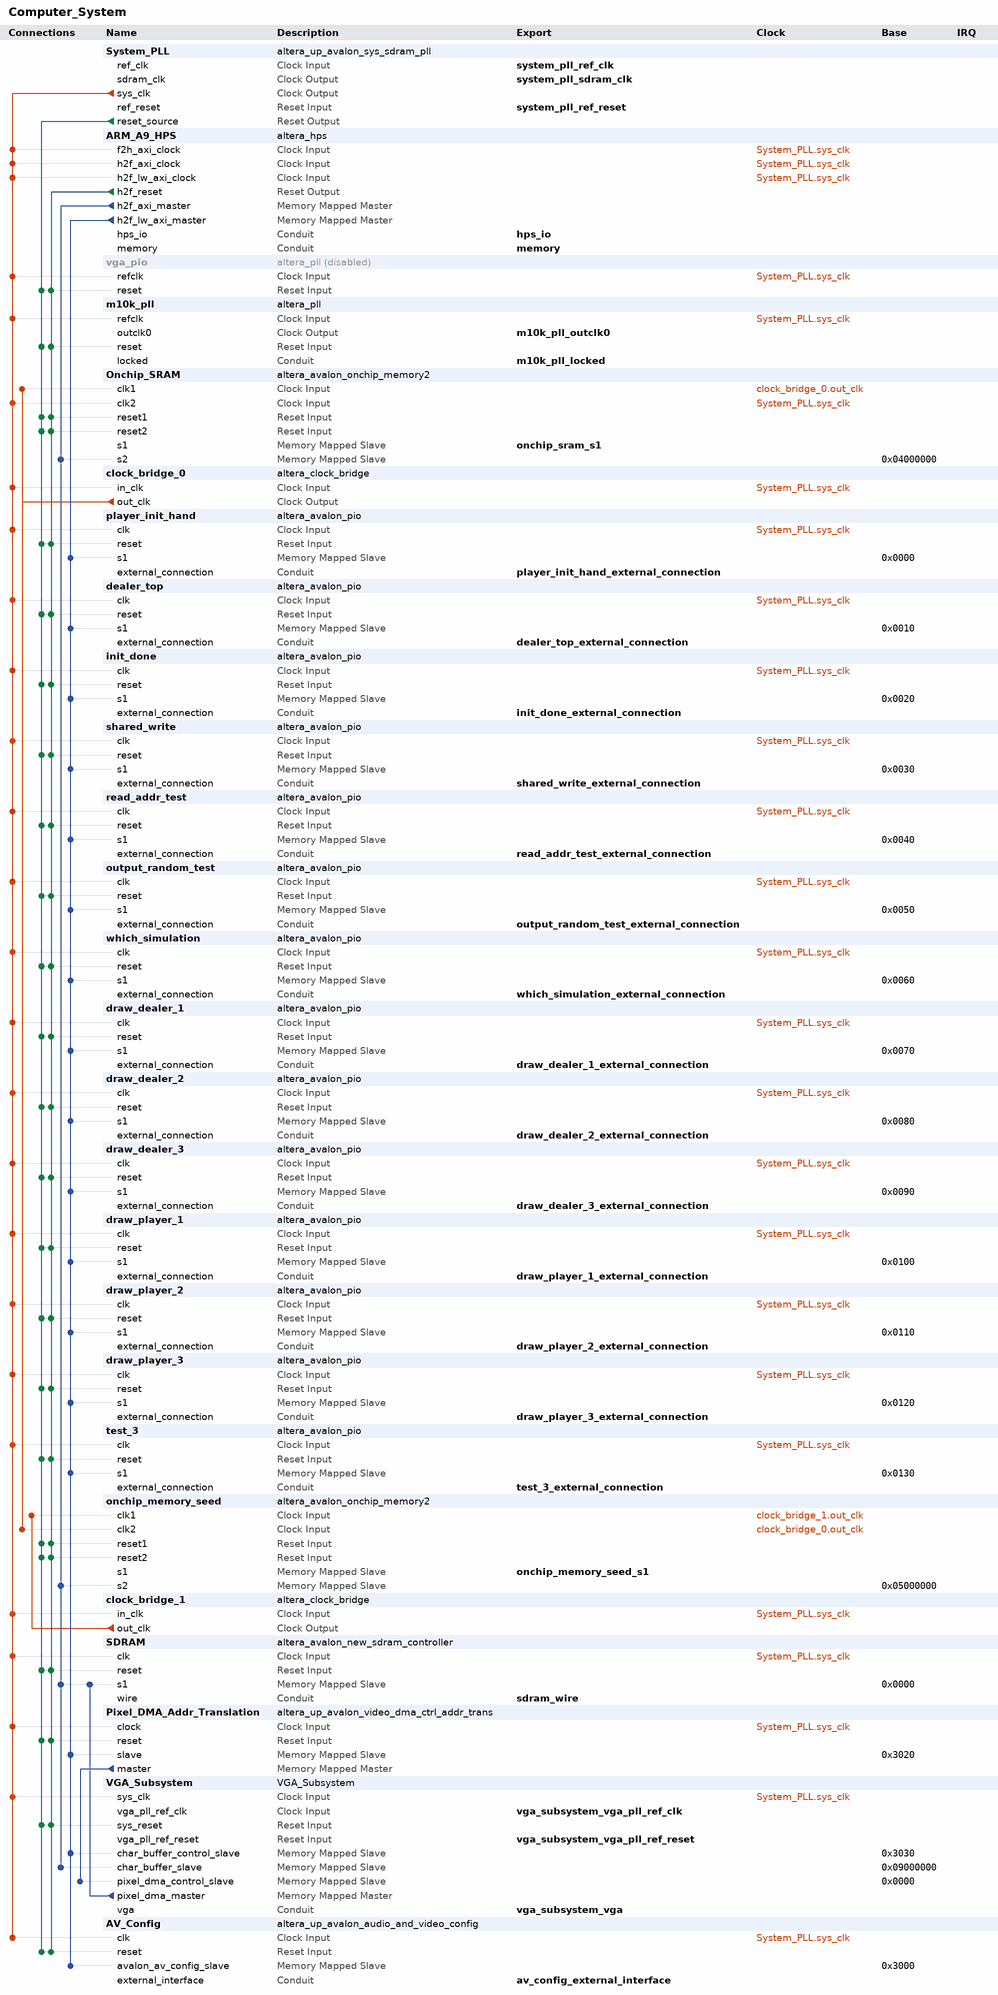
[diagram p0: system contents]
# Platform Designer (Qsys) system Computer_System, Cyclone V 5CSEMA5F31C6
# Parameters at their usual value, and those the tool derives, are not listed.
package require -exact qsys 18.1
create_system Computer_System
set_project_property DEVICE_FAMILY {Cyclone V}
set_project_property DEVICE 5CSEMA5F31C6

add_instance System_PLL altera_up_avalon_sys_sdram_pll 18.0
set_instance_parameter_value System_PLL CV_boards DE1-SoC
set_instance_parameter_value System_PLL gui_outclk 100.0
set_instance_parameter_value System_PLL gui_refclk 50.0

add_instance ARM_A9_HPS altera_hps 18.1
set_instance_parameter_value ARM_A9_HPS EMAC1_Mode RGMII
set_instance_parameter_value ARM_A9_HPS EMAC1_PinMuxing {HPS I/O Set 0}
set_instance_parameter_value ARM_A9_HPS F2SCLK_COLDRST_Enable false
set_instance_parameter_value ARM_A9_HPS F2SCLK_DBGRST_Enable false
set_instance_parameter_value ARM_A9_HPS F2SCLK_WARMRST_Enable false
set_instance_parameter_value ARM_A9_HPS F2SINTERRUPT_Enable true
set_instance_parameter_value ARM_A9_HPS F2S_Width 2
set_instance_parameter_value ARM_A9_HPS FPGA_PERIPHERAL_OUTPUT_CLOCK_FREQ_EMAC0_GTX_CLK 125
set_instance_parameter_value ARM_A9_HPS FPGA_PERIPHERAL_OUTPUT_CLOCK_FREQ_EMAC0_MD_CLK 100.0
set_instance_parameter_value ARM_A9_HPS FPGA_PERIPHERAL_OUTPUT_CLOCK_FREQ_EMAC1_GTX_CLK 125
set_instance_parameter_value ARM_A9_HPS FPGA_PERIPHERAL_OUTPUT_CLOCK_FREQ_EMAC1_MD_CLK 100.0
set_instance_parameter_value ARM_A9_HPS HPS_PROTOCOL DDR3
set_instance_parameter_value ARM_A9_HPS I2C0_Mode I2C
set_instance_parameter_value ARM_A9_HPS I2C0_PinMuxing {HPS I/O Set 0}
set_instance_parameter_value ARM_A9_HPS I2C1_Mode I2C
set_instance_parameter_value ARM_A9_HPS I2C1_PinMuxing {HPS I/O Set 0}
set_instance_parameter_value ARM_A9_HPS LWH2F_Enable true
set_instance_parameter_value ARM_A9_HPS MEM_BANKADDR_WIDTH 3
set_instance_parameter_value ARM_A9_HPS MEM_CLK_FREQ 400.0
set_instance_parameter_value ARM_A9_HPS MEM_COL_ADDR_WIDTH 10
set_instance_parameter_value ARM_A9_HPS MEM_DQ_WIDTH 32
set_instance_parameter_value ARM_A9_HPS MEM_DRV_STR RZQ/7
set_instance_parameter_value ARM_A9_HPS MEM_ROW_ADDR_WIDTH 15
set_instance_parameter_value ARM_A9_HPS MEM_RTT_NOM RZQ/4
set_instance_parameter_value ARM_A9_HPS MEM_RTT_WR RZQ/4
set_instance_parameter_value ARM_A9_HPS MEM_TCL 11
set_instance_parameter_value ARM_A9_HPS MEM_TFAW_NS 30.0
set_instance_parameter_value ARM_A9_HPS MEM_TRAS_NS 35.0
set_instance_parameter_value ARM_A9_HPS MEM_TRCD_NS 13.75
set_instance_parameter_value ARM_A9_HPS MEM_TRFC_NS 260.0
set_instance_parameter_value ARM_A9_HPS MEM_TRP_NS 13.75
set_instance_parameter_value ARM_A9_HPS MEM_VENDOR JEDEC
set_instance_parameter_value ARM_A9_HPS MEM_WTCL 8
set_instance_parameter_value ARM_A9_HPS QSPI_Mode {1 SS}
set_instance_parameter_value ARM_A9_HPS QSPI_PinMuxing {HPS I/O Set 0}
set_instance_parameter_value ARM_A9_HPS REF_CLK_FREQ 25.0
set_instance_parameter_value ARM_A9_HPS S2FCLK_USER2CLK 5
set_instance_parameter_value ARM_A9_HPS S2F_Width 3
set_instance_parameter_value ARM_A9_HPS SDIO_Mode {4-bit Data}
set_instance_parameter_value ARM_A9_HPS SDIO_PinMuxing {HPS I/O Set 0}
set_instance_parameter_value ARM_A9_HPS SPIM1_Mode {Single Slave Select}
set_instance_parameter_value ARM_A9_HPS SPIM1_PinMuxing {HPS I/O Set 0}
set_instance_parameter_value ARM_A9_HPS STM_Enable false
set_instance_parameter_value ARM_A9_HPS TIMING_BOARD_AC_SKEW 0.03
set_instance_parameter_value ARM_A9_HPS TIMING_BOARD_AC_TO_CK_SKEW 0.0
set_instance_parameter_value ARM_A9_HPS TIMING_BOARD_DQ_TO_DQS_SKEW 0.0
set_instance_parameter_value ARM_A9_HPS TIMING_BOARD_MAX_CK_DELAY 0.03
set_instance_parameter_value ARM_A9_HPS TIMING_BOARD_MAX_DQS_DELAY 0.02
set_instance_parameter_value ARM_A9_HPS TIMING_BOARD_SKEW_BETWEEN_DQS 0.08
set_instance_parameter_value ARM_A9_HPS TIMING_BOARD_SKEW_CKDQS_DIMM_MAX 0.16
set_instance_parameter_value ARM_A9_HPS TIMING_BOARD_SKEW_CKDQS_DIMM_MIN 0.09
set_instance_parameter_value ARM_A9_HPS TIMING_BOARD_SKEW_WITHIN_DQS 0.01
set_instance_parameter_value ARM_A9_HPS TIMING_TDH 65
set_instance_parameter_value ARM_A9_HPS TIMING_TDQSCK 255
set_instance_parameter_value ARM_A9_HPS TIMING_TDQSQ 125
set_instance_parameter_value ARM_A9_HPS TIMING_TDS 30
set_instance_parameter_value ARM_A9_HPS TIMING_TIH 140
set_instance_parameter_value ARM_A9_HPS TIMING_TIS 180
set_instance_parameter_value ARM_A9_HPS TIMING_TQSH 0.4
set_instance_parameter_value ARM_A9_HPS UART0_Mode {No Flow Control}
set_instance_parameter_value ARM_A9_HPS UART0_PinMuxing {HPS I/O Set 0}
set_instance_parameter_value ARM_A9_HPS USB1_Mode SDR
set_instance_parameter_value ARM_A9_HPS USB1_PinMuxing {HPS I/O Set 0}
set_instance_parameter_value ARM_A9_HPS desired_cfg_clk_mhz 100.0
set_instance_parameter_value ARM_A9_HPS desired_qspi_clk_mhz 400.0

add_instance vga_pio altera_pll 18.1
set_instance_property vga_pio ENABLED false
set_instance_parameter_value vga_pio gui_device_speed_grade 2
set_instance_parameter_value vga_pio gui_number_of_clocks 1
set_instance_parameter_value vga_pio gui_operation_mode direct
set_instance_parameter_value vga_pio gui_output_clock_frequency0 25.0
set_instance_parameter_value vga_pio gui_pll_mode {Integer-N PLL}
set_instance_parameter_value vga_pio gui_reference_clock_frequency 100.0
set_instance_parameter_value vga_pio gui_use_locked true

add_instance m10k_pll altera_pll 18.1
set_instance_parameter_value m10k_pll gui_device_speed_grade 2
set_instance_parameter_value m10k_pll gui_number_of_clocks 1
set_instance_parameter_value m10k_pll gui_operation_mode direct
set_instance_parameter_value m10k_pll gui_output_clock_frequency0 100.0
set_instance_parameter_value m10k_pll gui_pll_mode {Integer-N PLL}
set_instance_parameter_value m10k_pll gui_reference_clock_frequency 100.0
set_instance_parameter_value m10k_pll gui_use_locked true

add_instance Onchip_SRAM altera_avalon_onchip_memory2 18.1
set_instance_parameter_value Onchip_SRAM blockType M10K
set_instance_parameter_value Onchip_SRAM dataWidth 32
set_instance_parameter_value Onchip_SRAM dualPort true
set_instance_parameter_value Onchip_SRAM initMemContent true
set_instance_parameter_value Onchip_SRAM initializationFileName onchip_mem.hex
set_instance_parameter_value Onchip_SRAM memorySize 1248

add_instance clock_bridge_0 altera_clock_bridge 18.1
set_instance_parameter_value clock_bridge_0 DERIVED_CLOCK_RATE 100000000
set_instance_parameter_value clock_bridge_0 EXPLICIT_CLOCK_RATE 50000000

add_instance player_init_hand altera_avalon_pio 18.1
set_instance_parameter_value player_init_hand direction Output
set_instance_parameter_value player_init_hand width 8

add_instance dealer_top altera_avalon_pio 18.1
set_instance_parameter_value dealer_top direction Output
set_instance_parameter_value dealer_top width 8

add_instance init_done altera_avalon_pio 18.1
set_instance_parameter_value init_done direction Output
set_instance_parameter_value init_done width 8

add_instance shared_write altera_avalon_pio 18.1
set_instance_parameter_value shared_write direction Input
set_instance_parameter_value shared_write width 8

add_instance read_addr_test altera_avalon_pio 18.1
set_instance_parameter_value read_addr_test direction Input
set_instance_parameter_value read_addr_test width 8

add_instance output_random_test altera_avalon_pio 18.1
set_instance_parameter_value output_random_test direction Input
set_instance_parameter_value output_random_test width 32

add_instance which_simulation altera_avalon_pio 18.1
set_instance_parameter_value which_simulation direction Output
set_instance_parameter_value which_simulation width 8

add_instance draw_dealer_1 altera_avalon_pio 18.1
set_instance_parameter_value draw_dealer_1 direction Input
set_instance_parameter_value draw_dealer_1 width 8

add_instance draw_dealer_2 altera_avalon_pio 18.1
set_instance_parameter_value draw_dealer_2 direction Input
set_instance_parameter_value draw_dealer_2 width 8

add_instance draw_dealer_3 altera_avalon_pio 18.1
set_instance_parameter_value draw_dealer_3 direction Input
set_instance_parameter_value draw_dealer_3 width 8

add_instance draw_player_1 altera_avalon_pio 18.1
set_instance_parameter_value draw_player_1 direction Input
set_instance_parameter_value draw_player_1 width 8

add_instance draw_player_2 altera_avalon_pio 18.1
set_instance_parameter_value draw_player_2 direction Input
set_instance_parameter_value draw_player_2 width 8

add_instance draw_player_3 altera_avalon_pio 18.1
set_instance_parameter_value draw_player_3 direction Input
set_instance_parameter_value draw_player_3 width 8

add_instance test_3 altera_avalon_pio 18.1
set_instance_parameter_value test_3 direction Input
set_instance_parameter_value test_3 width 8

add_instance onchip_memory_seed altera_avalon_onchip_memory2 18.1
set_instance_parameter_value onchip_memory_seed blockType M10K
set_instance_parameter_value onchip_memory_seed dataWidth 32
set_instance_parameter_value onchip_memory_seed dualPort true
set_instance_parameter_value onchip_memory_seed initMemContent true
set_instance_parameter_value onchip_memory_seed initializationFileName onchip_mem.hex
set_instance_parameter_value onchip_memory_seed memorySize 10000

add_instance clock_bridge_1 altera_clock_bridge 18.1
set_instance_parameter_value clock_bridge_1 DERIVED_CLOCK_RATE 100000000
set_instance_parameter_value clock_bridge_1 EXPLICIT_CLOCK_RATE 50000000

add_instance SDRAM altera_avalon_new_sdram_controller 18.1
set_instance_parameter_value SDRAM TAC 5.5
set_instance_parameter_value SDRAM TRCD 20.0
set_instance_parameter_value SDRAM TRP 20.0
set_instance_parameter_value SDRAM casLatency 3
set_instance_parameter_value SDRAM columnWidth 10
set_instance_parameter_value SDRAM dataWidth 16
set_instance_parameter_value SDRAM generateSimulationModel true
set_instance_parameter_value SDRAM model single_Micron_MT48LC4M32B2_7_chip
set_instance_parameter_value SDRAM numberOfBanks 4
set_instance_parameter_value SDRAM numberOfChipSelects 1
set_instance_parameter_value SDRAM powerUpDelay 100.0
set_instance_parameter_value SDRAM refreshPeriod 15.625
set_instance_parameter_value SDRAM rowWidth 13

add_instance Pixel_DMA_Addr_Translation altera_up_avalon_video_dma_ctrl_addr_trans 18.0

add_instance VGA_Subsystem VGA_Subsystem 1.0

add_instance AV_Config altera_up_avalon_audio_and_video_config 18.0
set_instance_parameter_value AV_Config audio_in {Microphone to ADC}
set_instance_parameter_value AV_Config bit_length 32
set_instance_parameter_value AV_Config board DE1-SoC
set_instance_parameter_value AV_Config line_in_bypass false
set_instance_parameter_value AV_Config sampling_rate {48 kHz}

# connections
add_connection clock_bridge_0.out_clk onchip_memory_seed.clk2 clock
add_connection clock_bridge_0.out_clk Onchip_SRAM.clk1 clock
add_connection clock_bridge_1.out_clk onchip_memory_seed.clk1 clock
add_connection System_PLL.sys_clk ARM_A9_HPS.f2h_axi_clock clock
add_connection System_PLL.sys_clk ARM_A9_HPS.h2f_axi_clock clock
add_connection System_PLL.sys_clk ARM_A9_HPS.h2f_lw_axi_clock clock
add_connection System_PLL.sys_clk AV_Config.clk clock
add_connection System_PLL.sys_clk clock_bridge_0.in_clk clock
add_connection System_PLL.sys_clk clock_bridge_1.in_clk clock
add_connection System_PLL.sys_clk dealer_top.clk clock
add_connection System_PLL.sys_clk draw_dealer_1.clk clock
add_connection System_PLL.sys_clk draw_dealer_2.clk clock
add_connection System_PLL.sys_clk draw_dealer_3.clk clock
add_connection System_PLL.sys_clk draw_player_1.clk clock
add_connection System_PLL.sys_clk draw_player_2.clk clock
add_connection System_PLL.sys_clk draw_player_3.clk clock
add_connection System_PLL.sys_clk init_done.clk clock
add_connection System_PLL.sys_clk m10k_pll.refclk clock
add_connection System_PLL.sys_clk Onchip_SRAM.clk2 clock
add_connection System_PLL.sys_clk output_random_test.clk clock
add_connection System_PLL.sys_clk Pixel_DMA_Addr_Translation.clock clock
add_connection System_PLL.sys_clk player_init_hand.clk clock
add_connection System_PLL.sys_clk read_addr_test.clk clock
add_connection System_PLL.sys_clk SDRAM.clk clock
add_connection System_PLL.sys_clk shared_write.clk clock
add_connection System_PLL.sys_clk test_3.clk clock
add_connection System_PLL.sys_clk vga_pio.refclk clock
add_connection System_PLL.sys_clk VGA_Subsystem.sys_clk clock
add_connection System_PLL.sys_clk which_simulation.clk clock
add_connection ARM_A9_HPS.h2f_reset AV_Config.reset reset
add_connection ARM_A9_HPS.h2f_reset dealer_top.reset reset
add_connection ARM_A9_HPS.h2f_reset draw_dealer_1.reset reset
add_connection ARM_A9_HPS.h2f_reset draw_dealer_2.reset reset
add_connection ARM_A9_HPS.h2f_reset draw_dealer_3.reset reset
add_connection ARM_A9_HPS.h2f_reset draw_player_1.reset reset
add_connection ARM_A9_HPS.h2f_reset draw_player_2.reset reset
add_connection ARM_A9_HPS.h2f_reset draw_player_3.reset reset
add_connection ARM_A9_HPS.h2f_reset init_done.reset reset
add_connection ARM_A9_HPS.h2f_reset m10k_pll.reset reset
add_connection ARM_A9_HPS.h2f_reset onchip_memory_seed.reset1 reset
add_connection ARM_A9_HPS.h2f_reset onchip_memory_seed.reset2 reset
add_connection ARM_A9_HPS.h2f_reset Onchip_SRAM.reset1 reset
add_connection ARM_A9_HPS.h2f_reset Onchip_SRAM.reset2 reset
add_connection ARM_A9_HPS.h2f_reset output_random_test.reset reset
add_connection ARM_A9_HPS.h2f_reset Pixel_DMA_Addr_Translation.reset reset
add_connection ARM_A9_HPS.h2f_reset player_init_hand.reset reset
add_connection ARM_A9_HPS.h2f_reset read_addr_test.reset reset
add_connection ARM_A9_HPS.h2f_reset SDRAM.reset reset
add_connection ARM_A9_HPS.h2f_reset shared_write.reset reset
add_connection ARM_A9_HPS.h2f_reset test_3.reset reset
add_connection ARM_A9_HPS.h2f_reset vga_pio.reset reset
add_connection ARM_A9_HPS.h2f_reset VGA_Subsystem.sys_reset reset
add_connection ARM_A9_HPS.h2f_reset which_simulation.reset reset
add_connection System_PLL.reset_source AV_Config.reset reset
add_connection System_PLL.reset_source dealer_top.reset reset
add_connection System_PLL.reset_source draw_dealer_1.reset reset
add_connection System_PLL.reset_source draw_dealer_2.reset reset
add_connection System_PLL.reset_source draw_dealer_3.reset reset
add_connection System_PLL.reset_source draw_player_1.reset reset
add_connection System_PLL.reset_source draw_player_2.reset reset
add_connection System_PLL.reset_source draw_player_3.reset reset
add_connection System_PLL.reset_source init_done.reset reset
add_connection System_PLL.reset_source m10k_pll.reset reset
add_connection System_PLL.reset_source onchip_memory_seed.reset1 reset
add_connection System_PLL.reset_source onchip_memory_seed.reset2 reset
add_connection System_PLL.reset_source Onchip_SRAM.reset1 reset
add_connection System_PLL.reset_source Onchip_SRAM.reset2 reset
add_connection System_PLL.reset_source output_random_test.reset reset
add_connection System_PLL.reset_source Pixel_DMA_Addr_Translation.reset reset
add_connection System_PLL.reset_source player_init_hand.reset reset
add_connection System_PLL.reset_source read_addr_test.reset reset
add_connection System_PLL.reset_source SDRAM.reset reset
add_connection System_PLL.reset_source shared_write.reset reset
add_connection System_PLL.reset_source test_3.reset reset
add_connection System_PLL.reset_source vga_pio.reset reset
add_connection System_PLL.reset_source VGA_Subsystem.sys_reset reset
add_connection System_PLL.reset_source which_simulation.reset reset
add_connection ARM_A9_HPS.h2f_axi_master onchip_memory_seed.s2 avalon
set_connection_parameter_value ARM_A9_HPS.h2f_axi_master/onchip_memory_seed.s2 baseAddress 0x05000000
add_connection ARM_A9_HPS.h2f_axi_master Onchip_SRAM.s2 avalon
set_connection_parameter_value ARM_A9_HPS.h2f_axi_master/Onchip_SRAM.s2 baseAddress 0x04000000
add_connection ARM_A9_HPS.h2f_axi_master SDRAM.s1 avalon
set_connection_parameter_value ARM_A9_HPS.h2f_axi_master/SDRAM.s1 baseAddress 0x0000
add_connection ARM_A9_HPS.h2f_axi_master VGA_Subsystem.char_buffer_slave avalon
set_connection_parameter_value ARM_A9_HPS.h2f_axi_master/VGA_Subsystem.char_buffer_slave baseAddress 0x09000000
add_connection ARM_A9_HPS.h2f_lw_axi_master AV_Config.avalon_av_config_slave avalon
set_connection_parameter_value ARM_A9_HPS.h2f_lw_axi_master/AV_Config.avalon_av_config_slave baseAddress 0x3000
add_connection ARM_A9_HPS.h2f_lw_axi_master dealer_top.s1 avalon
set_connection_parameter_value ARM_A9_HPS.h2f_lw_axi_master/dealer_top.s1 baseAddress 0x0010
add_connection ARM_A9_HPS.h2f_lw_axi_master draw_dealer_1.s1 avalon
set_connection_parameter_value ARM_A9_HPS.h2f_lw_axi_master/draw_dealer_1.s1 baseAddress 0x0070
add_connection ARM_A9_HPS.h2f_lw_axi_master draw_dealer_2.s1 avalon
set_connection_parameter_value ARM_A9_HPS.h2f_lw_axi_master/draw_dealer_2.s1 baseAddress 0x0080
add_connection ARM_A9_HPS.h2f_lw_axi_master draw_dealer_3.s1 avalon
set_connection_parameter_value ARM_A9_HPS.h2f_lw_axi_master/draw_dealer_3.s1 baseAddress 0x0090
add_connection ARM_A9_HPS.h2f_lw_axi_master draw_player_1.s1 avalon
set_connection_parameter_value ARM_A9_HPS.h2f_lw_axi_master/draw_player_1.s1 baseAddress 0x0100
add_connection ARM_A9_HPS.h2f_lw_axi_master draw_player_2.s1 avalon
set_connection_parameter_value ARM_A9_HPS.h2f_lw_axi_master/draw_player_2.s1 baseAddress 0x0110
add_connection ARM_A9_HPS.h2f_lw_axi_master draw_player_3.s1 avalon
set_connection_parameter_value ARM_A9_HPS.h2f_lw_axi_master/draw_player_3.s1 baseAddress 0x0120
add_connection ARM_A9_HPS.h2f_lw_axi_master init_done.s1 avalon
set_connection_parameter_value ARM_A9_HPS.h2f_lw_axi_master/init_done.s1 baseAddress 0x0020
add_connection ARM_A9_HPS.h2f_lw_axi_master output_random_test.s1 avalon
set_connection_parameter_value ARM_A9_HPS.h2f_lw_axi_master/output_random_test.s1 baseAddress 0x0050
add_connection ARM_A9_HPS.h2f_lw_axi_master Pixel_DMA_Addr_Translation.slave avalon
set_connection_parameter_value ARM_A9_HPS.h2f_lw_axi_master/Pixel_DMA_Addr_Translation.slave baseAddress 0x3020
add_connection ARM_A9_HPS.h2f_lw_axi_master player_init_hand.s1 avalon
set_connection_parameter_value ARM_A9_HPS.h2f_lw_axi_master/player_init_hand.s1 baseAddress 0x0000
add_connection ARM_A9_HPS.h2f_lw_axi_master read_addr_test.s1 avalon
set_connection_parameter_value ARM_A9_HPS.h2f_lw_axi_master/read_addr_test.s1 baseAddress 0x0040
add_connection ARM_A9_HPS.h2f_lw_axi_master shared_write.s1 avalon
set_connection_parameter_value ARM_A9_HPS.h2f_lw_axi_master/shared_write.s1 baseAddress 0x0030
add_connection ARM_A9_HPS.h2f_lw_axi_master test_3.s1 avalon
set_connection_parameter_value ARM_A9_HPS.h2f_lw_axi_master/test_3.s1 baseAddress 0x0130
add_connection ARM_A9_HPS.h2f_lw_axi_master VGA_Subsystem.char_buffer_control_slave avalon
set_connection_parameter_value ARM_A9_HPS.h2f_lw_axi_master/VGA_Subsystem.char_buffer_control_slave baseAddress 0x3030
add_connection ARM_A9_HPS.h2f_lw_axi_master which_simulation.s1 avalon
set_connection_parameter_value ARM_A9_HPS.h2f_lw_axi_master/which_simulation.s1 baseAddress 0x0060
add_connection Pixel_DMA_Addr_Translation.master VGA_Subsystem.pixel_dma_control_slave avalon
set_connection_parameter_value Pixel_DMA_Addr_Translation.master/VGA_Subsystem.pixel_dma_control_slave baseAddress 0x0000
add_connection VGA_Subsystem.pixel_dma_master SDRAM.s1 avalon
set_connection_parameter_value VGA_Subsystem.pixel_dma_master/SDRAM.s1 baseAddress 0x0000

# exported interfaces
add_interface av_config_external_interface conduit end
set_interface_property av_config_external_interface EXPORT_OF AV_Config.external_interface
add_interface dealer_top_external_connection conduit end
set_interface_property dealer_top_external_connection EXPORT_OF dealer_top.external_connection
add_interface draw_dealer_1_external_connection conduit end
set_interface_property draw_dealer_1_external_connection EXPORT_OF draw_dealer_1.external_connection
add_interface draw_dealer_2_external_connection conduit end
set_interface_property draw_dealer_2_external_connection EXPORT_OF draw_dealer_2.external_connection
add_interface draw_dealer_3_external_connection conduit end
set_interface_property draw_dealer_3_external_connection EXPORT_OF draw_dealer_3.external_connection
add_interface draw_player_1_external_connection conduit end
set_interface_property draw_player_1_external_connection EXPORT_OF draw_player_1.external_connection
add_interface draw_player_2_external_connection conduit end
set_interface_property draw_player_2_external_connection EXPORT_OF draw_player_2.external_connection
add_interface draw_player_3_external_connection conduit end
set_interface_property draw_player_3_external_connection EXPORT_OF draw_player_3.external_connection
add_interface hps_io conduit end
set_interface_property hps_io EXPORT_OF ARM_A9_HPS.hps_io
add_interface init_done_external_connection conduit end
set_interface_property init_done_external_connection EXPORT_OF init_done.external_connection
add_interface m10k_pll_locked conduit end
set_interface_property m10k_pll_locked EXPORT_OF m10k_pll.locked
add_interface m10k_pll_outclk0 clock source
set_interface_property m10k_pll_outclk0 EXPORT_OF m10k_pll.outclk0
add_interface memory conduit end
set_interface_property memory EXPORT_OF ARM_A9_HPS.memory
add_interface onchip_memory_seed_s1 avalon slave
set_interface_property onchip_memory_seed_s1 EXPORT_OF onchip_memory_seed.s1
add_interface onchip_sram_s1 avalon slave
set_interface_property onchip_sram_s1 EXPORT_OF Onchip_SRAM.s1
add_interface output_random_test_external_connection conduit end
set_interface_property output_random_test_external_connection EXPORT_OF output_random_test.external_connection
add_interface player_init_hand_external_connection conduit end
set_interface_property player_init_hand_external_connection EXPORT_OF player_init_hand.external_connection
add_interface read_addr_test_external_connection conduit end
set_interface_property read_addr_test_external_connection EXPORT_OF read_addr_test.external_connection
add_interface sdram_wire conduit end
set_interface_property sdram_wire EXPORT_OF SDRAM.wire
add_interface shared_write_external_connection conduit end
set_interface_property shared_write_external_connection EXPORT_OF shared_write.external_connection
add_interface system_pll_ref_clk clock sink
set_interface_property system_pll_ref_clk EXPORT_OF System_PLL.ref_clk
add_interface system_pll_ref_reset reset sink
set_interface_property system_pll_ref_reset EXPORT_OF System_PLL.ref_reset
add_interface system_pll_sdram_clk clock source
set_interface_property system_pll_sdram_clk EXPORT_OF System_PLL.sdram_clk
add_interface test_3_external_connection conduit end
set_interface_property test_3_external_connection EXPORT_OF test_3.external_connection
add_interface vga_subsystem_vga conduit end
set_interface_property vga_subsystem_vga EXPORT_OF VGA_Subsystem.vga
add_interface vga_subsystem_vga_pll_ref_clk clock sink
set_interface_property vga_subsystem_vga_pll_ref_clk EXPORT_OF VGA_Subsystem.vga_pll_ref_clk
add_interface vga_subsystem_vga_pll_ref_reset reset sink
set_interface_property vga_subsystem_vga_pll_ref_reset EXPORT_OF VGA_Subsystem.vga_pll_ref_reset
add_interface which_simulation_external_connection conduit end
set_interface_property which_simulation_external_connection EXPORT_OF which_simulation.external_connection

set_interconnect_requirement {$system} qsys_mm.clockCrossingAdapter HANDSHAKE
set_interconnect_requirement {$system} qsys_mm.enableEccProtection FALSE
set_interconnect_requirement {$system} qsys_mm.insertDefaultSlave FALSE
set_interconnect_requirement {$system} qsys_mm.maxAdditionalLatency 1

save_system Computer_System.qsys
